# Altium schematic sheet Power.SchDoc
size A4; SheetNumber: 2; SheetTotal: 2
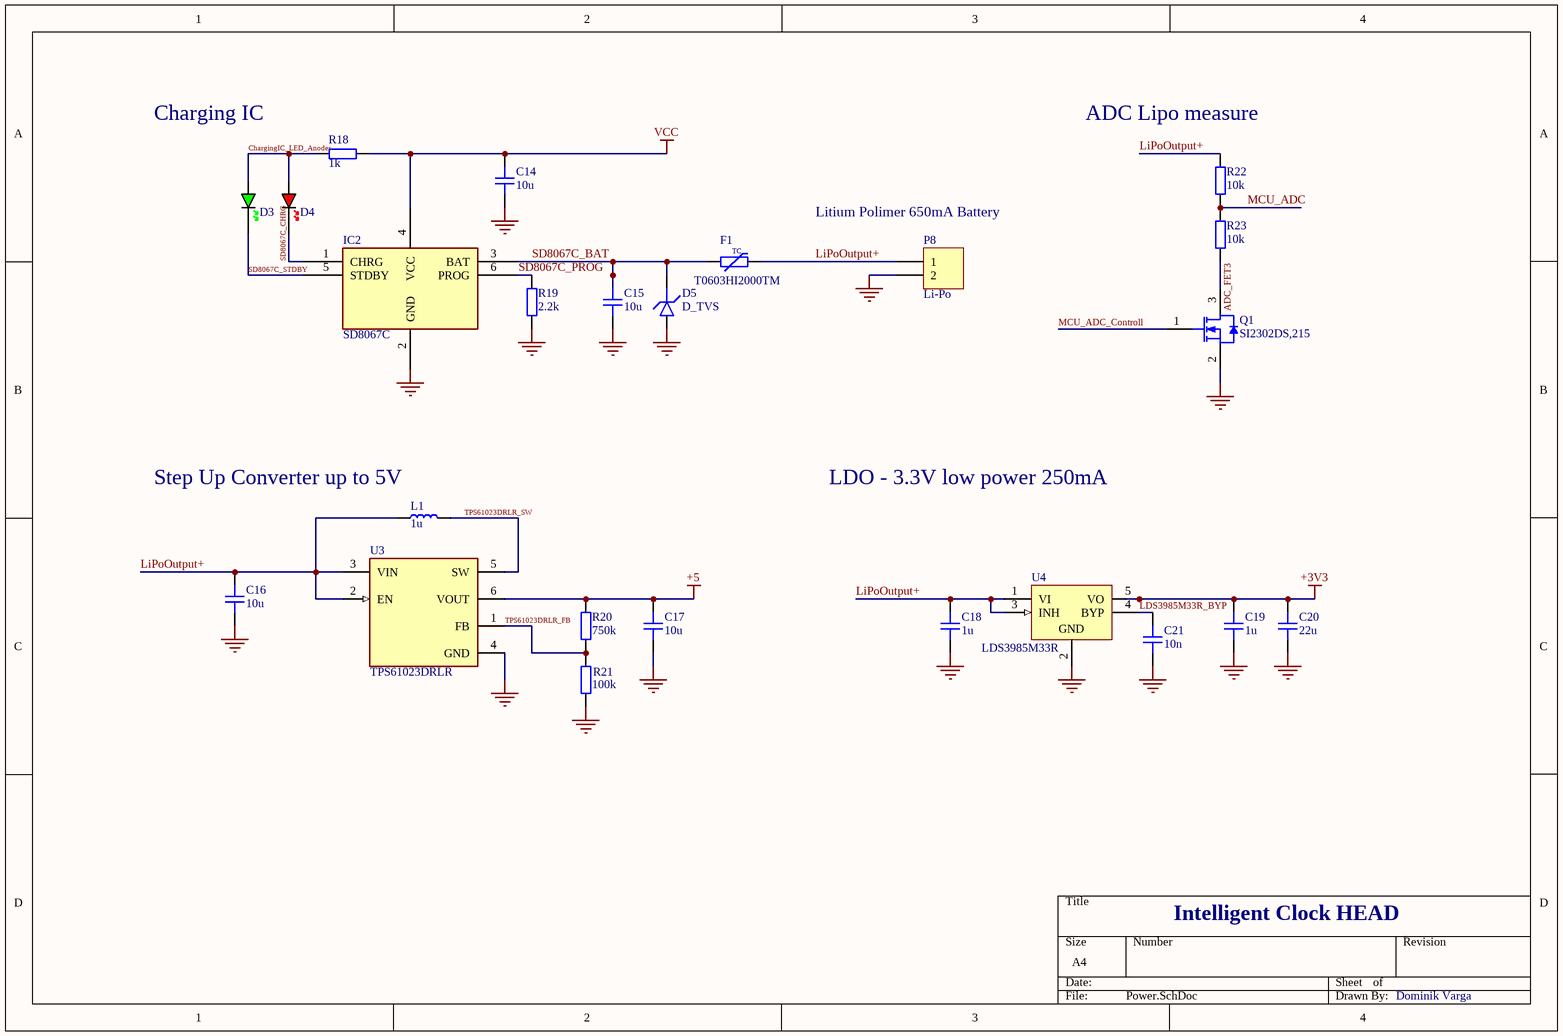
[diagram p0: Power.SchDoc]

## Parts
C14  10u  [CAP_0603]
C15  10u  [CAP_0603]
C16  10u  [CAP_0603]
C17  10u  [CAP_0603]
C18  1u  [CAP_0603]
C19  1u  [CAP_0603]
C20  22u  [CAP_0603]
C21  10n  [CAP_0603]
D3  GREEN  [LED_0603_GREEN]  (value not drawn)
D4  RED  [LED_0603_RED]  (value not drawn)
D5  D_TVS  [DIOM2718X14N]
F1  T0603HI2000TM  [RESC1608X06N]
IC2  SD8067C  [SOT95P280X125-6N]
L1  1u  [IND_1210]
P8  Li-Po  [HDR1X2H]
Q1  SI2302DS,215  [NXP-SOT23_N]
R18  1k  [RES_0603]
R19  2.2k  [RES_0603]
R20  750k  [RES_0603]
R21  100k  [RES_0603]
R22  10k  [RES_0603]
R23  10k  [RES_0603]
U3  TPS61023DRLR  [FP-DRL0006A-MFG]
U4  LDS3985M33R  [SOT23-5L_M]

## Nets
+3V3: C19.2 C20.2 U4.5(VO)
+5: C17.2 R20.2 U3.6(VOUT)
GND: C14.1 C15.1 C16.1 C17.1 C18.1 C19.1 C20.1 C21.1 D5.2(A) IC2.2(GND) P8.2 Q1.2(S) R19.2 R21.1 U3.4(GND) U4.2(GND)
VCC: C14.2 IC2.4(VCC) R18.2
ADC_FET3: Q1.3(D) R23.1
ChargingIC_LED_Anodes: D3.A D4.A R18.1
LDS3985M33R_BYP: C21.2 U4.4(BYP)
LiPoOutput+: C16.2 C18.2 F1.2 L1.1 P8.1 R22.2 U3.2(EN) U3.3(VIN) U4.1(VI) U4.3(INH)
MCU_ADC: R22.1 R23.2
MCU_ADC_Controll: Q1.1(G)
SD8067C_BAT: C15.2 D5.1(K) F1.1 IC2.3(BAT)
SD8067C_CHRG: D4.K IC2.1(CHRG)
SD8067C_PROG: IC2.6(PROG) R19.1
SD8067C_STDBY: D3.K IC2.5(STDBY)
TPS61023DRLR_FB: R20.1 R21.2 U3.1(FB)
TPS61023DRLR_SW: L1.2 U3.5(SW)

## Notes on the sheet
- Charging IC
- (near R22) ADC Lipo measure
- (near P8) Litium Polimer 650mA Battery
- (near L1) Step Up Converter up to 5V
- LDO - 3.3V low power 250mA
- (near C20) áram tartalék
  biztonság érdekében
- Intelligent Clock HEAD
- Dominik Varga
- (in symbol FUSE_0603) TC

## Library data of the parts
C14-C21 = CAP_0603_10V: Capacitor SMD 0603 10V
D3 = LED_0603_GREEN: LED 0603 GREEN SMD
D4 = LED_0603_RED: LED 0603 RED SMD
D5 = D_TVS_0603: Diode TVS / ESD 0603
F1 = FUSE_0603: Fuse SMD 0603; Manufacturer: AEM; Manufacturer Part Number: T0603HI2000TM; DataSheet: https://datasheet.lcsc.com/lcsc/1811151158_AEM-T0603HI2000TM_C311070.pdf
IC2 = SD8067C: Integrated Circuit, charging circuit; Manufacturer: Shouding; Manufacturer Part Number: SD8067C
L1 = IND_1210: Inductor SMD 1210
P8 = Header 2H: Header, 2-Pin, Right Angle; LatestRevisionDate: 17-Jul-2002; LatestRevisionNote: Re-released for DXP Platform.; Publisher: Altium Limited
Q1 = CMP-1258-00133-1: N-Channel Enhancement Mode Field-Effect Transistor, 20 V, 2.5 A, 3-Pin SOT23, Tape and Reel; Manufacturer: NXP Semiconductors; Ciss [typ] (pF): 230; VDS [max] (V): 20; Channel Type: N; Coss [typ] (pF): 125; ID [max] (A): 2.5; Packing: Tape & Reel; DatasheetVersion: Rev. 02; PackageVersion: 06-03-16, 03/2006; Code_JEDEC: TO-236AB; ComponentLink3Description: Package Specification; PartNumber: SI2302DS,215; ComponentLink2URL: http://www.nxp.com/documents/data_sheet/SI2302DS.pdf; PackageDescription: 3-Pin Small Outline Transistor Package, Body 2.9 x 1.3 mm, Pitch 0.95 mm; ComponentLink2Description: Datasheet; ComponentLink1Description: Manufacturer URL; Mounting Technology: Surface Mount; ComponentLink1URL: http://www.nxp.com/; ComponentLink3URL: http://www.nxp.com/documents/outline_drawing/sot023_po.pdf; PackageReference: SOT23
R18-R23 = RES_0603: Resistor SMD 0603
U3 = CMP-04918-000638-1: FINISH GOODS FOR TPS61023; DataSheet: https://www.ti.com/lit/ds/symlink/tps61023.pdf?ts=1666270495788&ref_url=https%253A%252F%252Fwww.ti.com%252Fproduct%252FTPS61023%253FHQS%253Dti-null-null-verifimanuf_manuf-manu-pf-octopart-wwe
U4 = CMP-0244-00363-1: Ultra Low Drop Low Noise BiCMOS 300 mA Voltage Regulator for use with Very Low ESR Output Capacitor, 3.3V, 5-Pin SOT-23, Tape and Reel; ComponentLink2Description: Datasheet; ComponentLink2URL: http://www.st.com/internet/com/TECHNICAL_RESOURCES/TECHNICAL_LITERATURE/DATASHEET/CD00047465.pdf; PackageDescription: 5-Pin SOT-23 Package, 2.9 x 1.6 mm Body, 0.95 mm Pitch, 2.8 mm Lead Span; ComponentLink1Description: Manufacturer URL; ComponentLink1URL: http://www.st.com; DatasheetVersion: 1/07/2010; PackageVersion: 1/01/2008; PackageReference: SOT23-5L